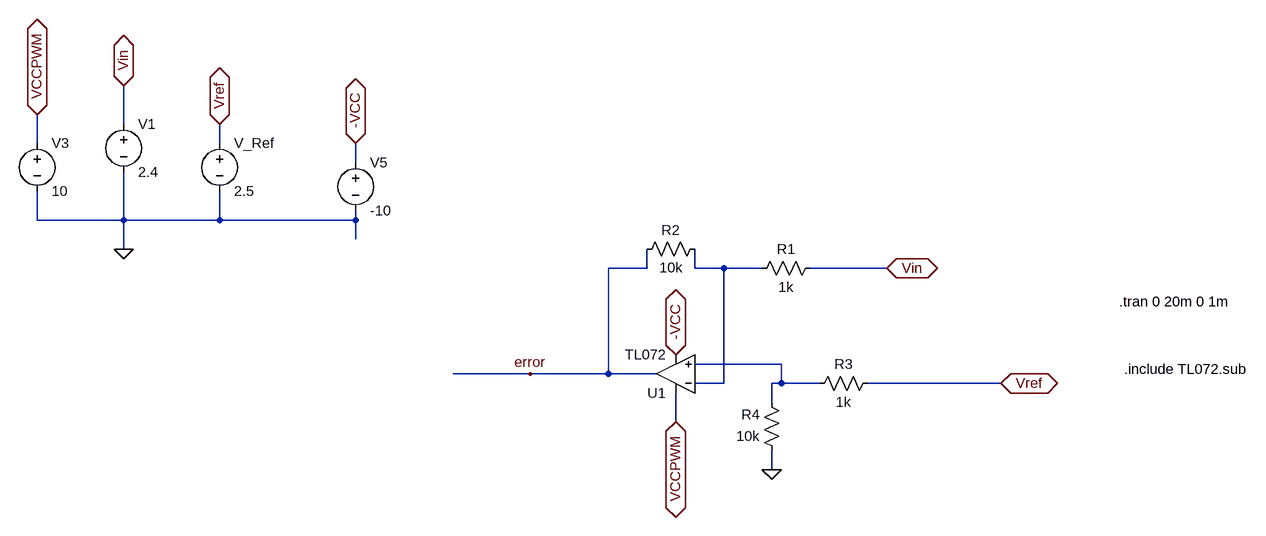
[diagram p0: schematic Diferen.asc]
Diferen.asc, the LTspice schematic file:
Version 4.1
SHEET 1 3160 1976
WIRE -1552 560 -1552 496
WIRE -1696 592 -1696 544
WIRE -1392 592 -1392 560
WIRE -1120 624 -1120 592
WIRE -1696 720 -1696 672
WIRE -1552 720 -1552 640
WIRE -1552 720 -1696 720
WIRE -1392 720 -1392 672
WIRE -1392 720 -1552 720
WIRE -1120 720 -1120 704
WIRE -1120 720 -1392 720
WIRE -1120 752 -1120 720
WIRE -1552 768 -1552 720
WIRE 304 800 304 768
WIRE 304 800 240 800
WIRE 384 800 384 768
WIRE 432 800 384 800
WIRE 496 800 432 800
WIRE 704 800 576 800
WIRE 528 960 384 960
WIRE 96 976 -304 976
WIRE 240 976 240 800
WIRE 240 976 96 976
WIRE 320 976 240 976
WIRE 432 992 432 800
WIRE 432 992 384 992
WIRE 528 992 528 960
WIRE 528 992 512 992
WIRE 592 992 528 992
WIRE 976 992 672 992
WIRE 512 1024 512 992
WIRE 352 1056 352 1008
WIRE 512 1136 512 1104
FLAG -1696 544 VCCPWM
IOPIN -1696 544 BiDir
FLAG -1552 496 Vin
IOPIN -1552 496 BiDir
FLAG 96 976 error
FLAG -1392 560 Vref
IOPIN -1392 560 BiDir
FLAG -1552 768 0
FLAG 976 992 Vref
IOPIN 976 992 BiDir
FLAG 512 1136 0
FLAG 704 800 Vin
IOPIN 704 800 BiDir
FLAG -1120 592 -VCC
IOPIN -1120 592 BiDir
FLAG 352 1056 VCCPWM
IOPIN 352 1056 BiDir
FLAG 352 944 -VCC
IOPIN 352 944 BiDir
SYMBOL voltage -1552 544 R0
WINDOW 123 0 0 Left 0
WINDOW 39 0 0 Left 0
SYMATTR InstName V1
SYMATTR Value 2.4
SYMBOL voltage -1696 576 R0
WINDOW 123 0 0 Left 0
WINDOW 39 0 0 Left 0
SYMATTR InstName V3
SYMATTR Value 10
SYMBOL voltage -1392 576 R0
WINDOW 123 0 0 Left 0
WINDOW 39 0 0 Left 0
SYMATTR InstName V_Ref
SYMATTR Value 2.5
SYMBOL res 400 752 R90
WINDOW 0 0 56 VBottom 2
WINDOW 3 32 56 VTop 2
SYMATTR InstName R2
SYMATTR Value 10k
SYMBOL res 592 784 R90
WINDOW 0 0 56 VBottom 2
WINDOW 3 32 56 VTop 2
SYMATTR InstName R1
SYMATTR Value 1k
SYMBOL res 688 976 R90
WINDOW 0 0 56 VBottom 2
WINDOW 3 32 56 VTop 2
SYMATTR InstName R3
SYMATTR Value 1k
SYMBOL res 528 1120 R180
WINDOW 0 36 76 Left 2
WINDOW 3 36 40 Left 2
SYMATTR InstName R4
SYMATTR Value 10k
SYMBOL OpAmps\\opamp2 352 1040 R180
SYMATTR InstName U1
SYMATTR Value TL072
SYMBOL voltage -1120 608 R0
WINDOW 123 0 0 Left 0
WINDOW 39 0 0 Left 0
SYMATTR InstName V5
SYMATTR Value -10
TEXT 1760 856 Left 2 !.tran 0 20m 0 1m
TEXT 1768 968 Left 2 !.include TL072.sub

The netlist it stands for:
* Diferen.asc
V1 Vin 0 2.4
V3 VCCPWM 0 10
V_Ref Vref 0 2.5
R2 N001 error 10k
R1 Vin N001 1k
R3 Vref N002 1k
R4 0 N002 10k
X§U1 N002 N001 VCCPWM -VCC error TL072  ; pins In+ In- V+ V- OUT
V5 -VCC 0 -10
.tran 0 20m 0 1m
.include TL072.sub
.backanno
.end